# EasyEDA schematic 02 - EasyEDA.json
TITLE: ESPWater; REV: 1.0; Date: 2022-09-15; Sheet: 1/1; Drawn By: ShonP40; Company: https://shon.codes
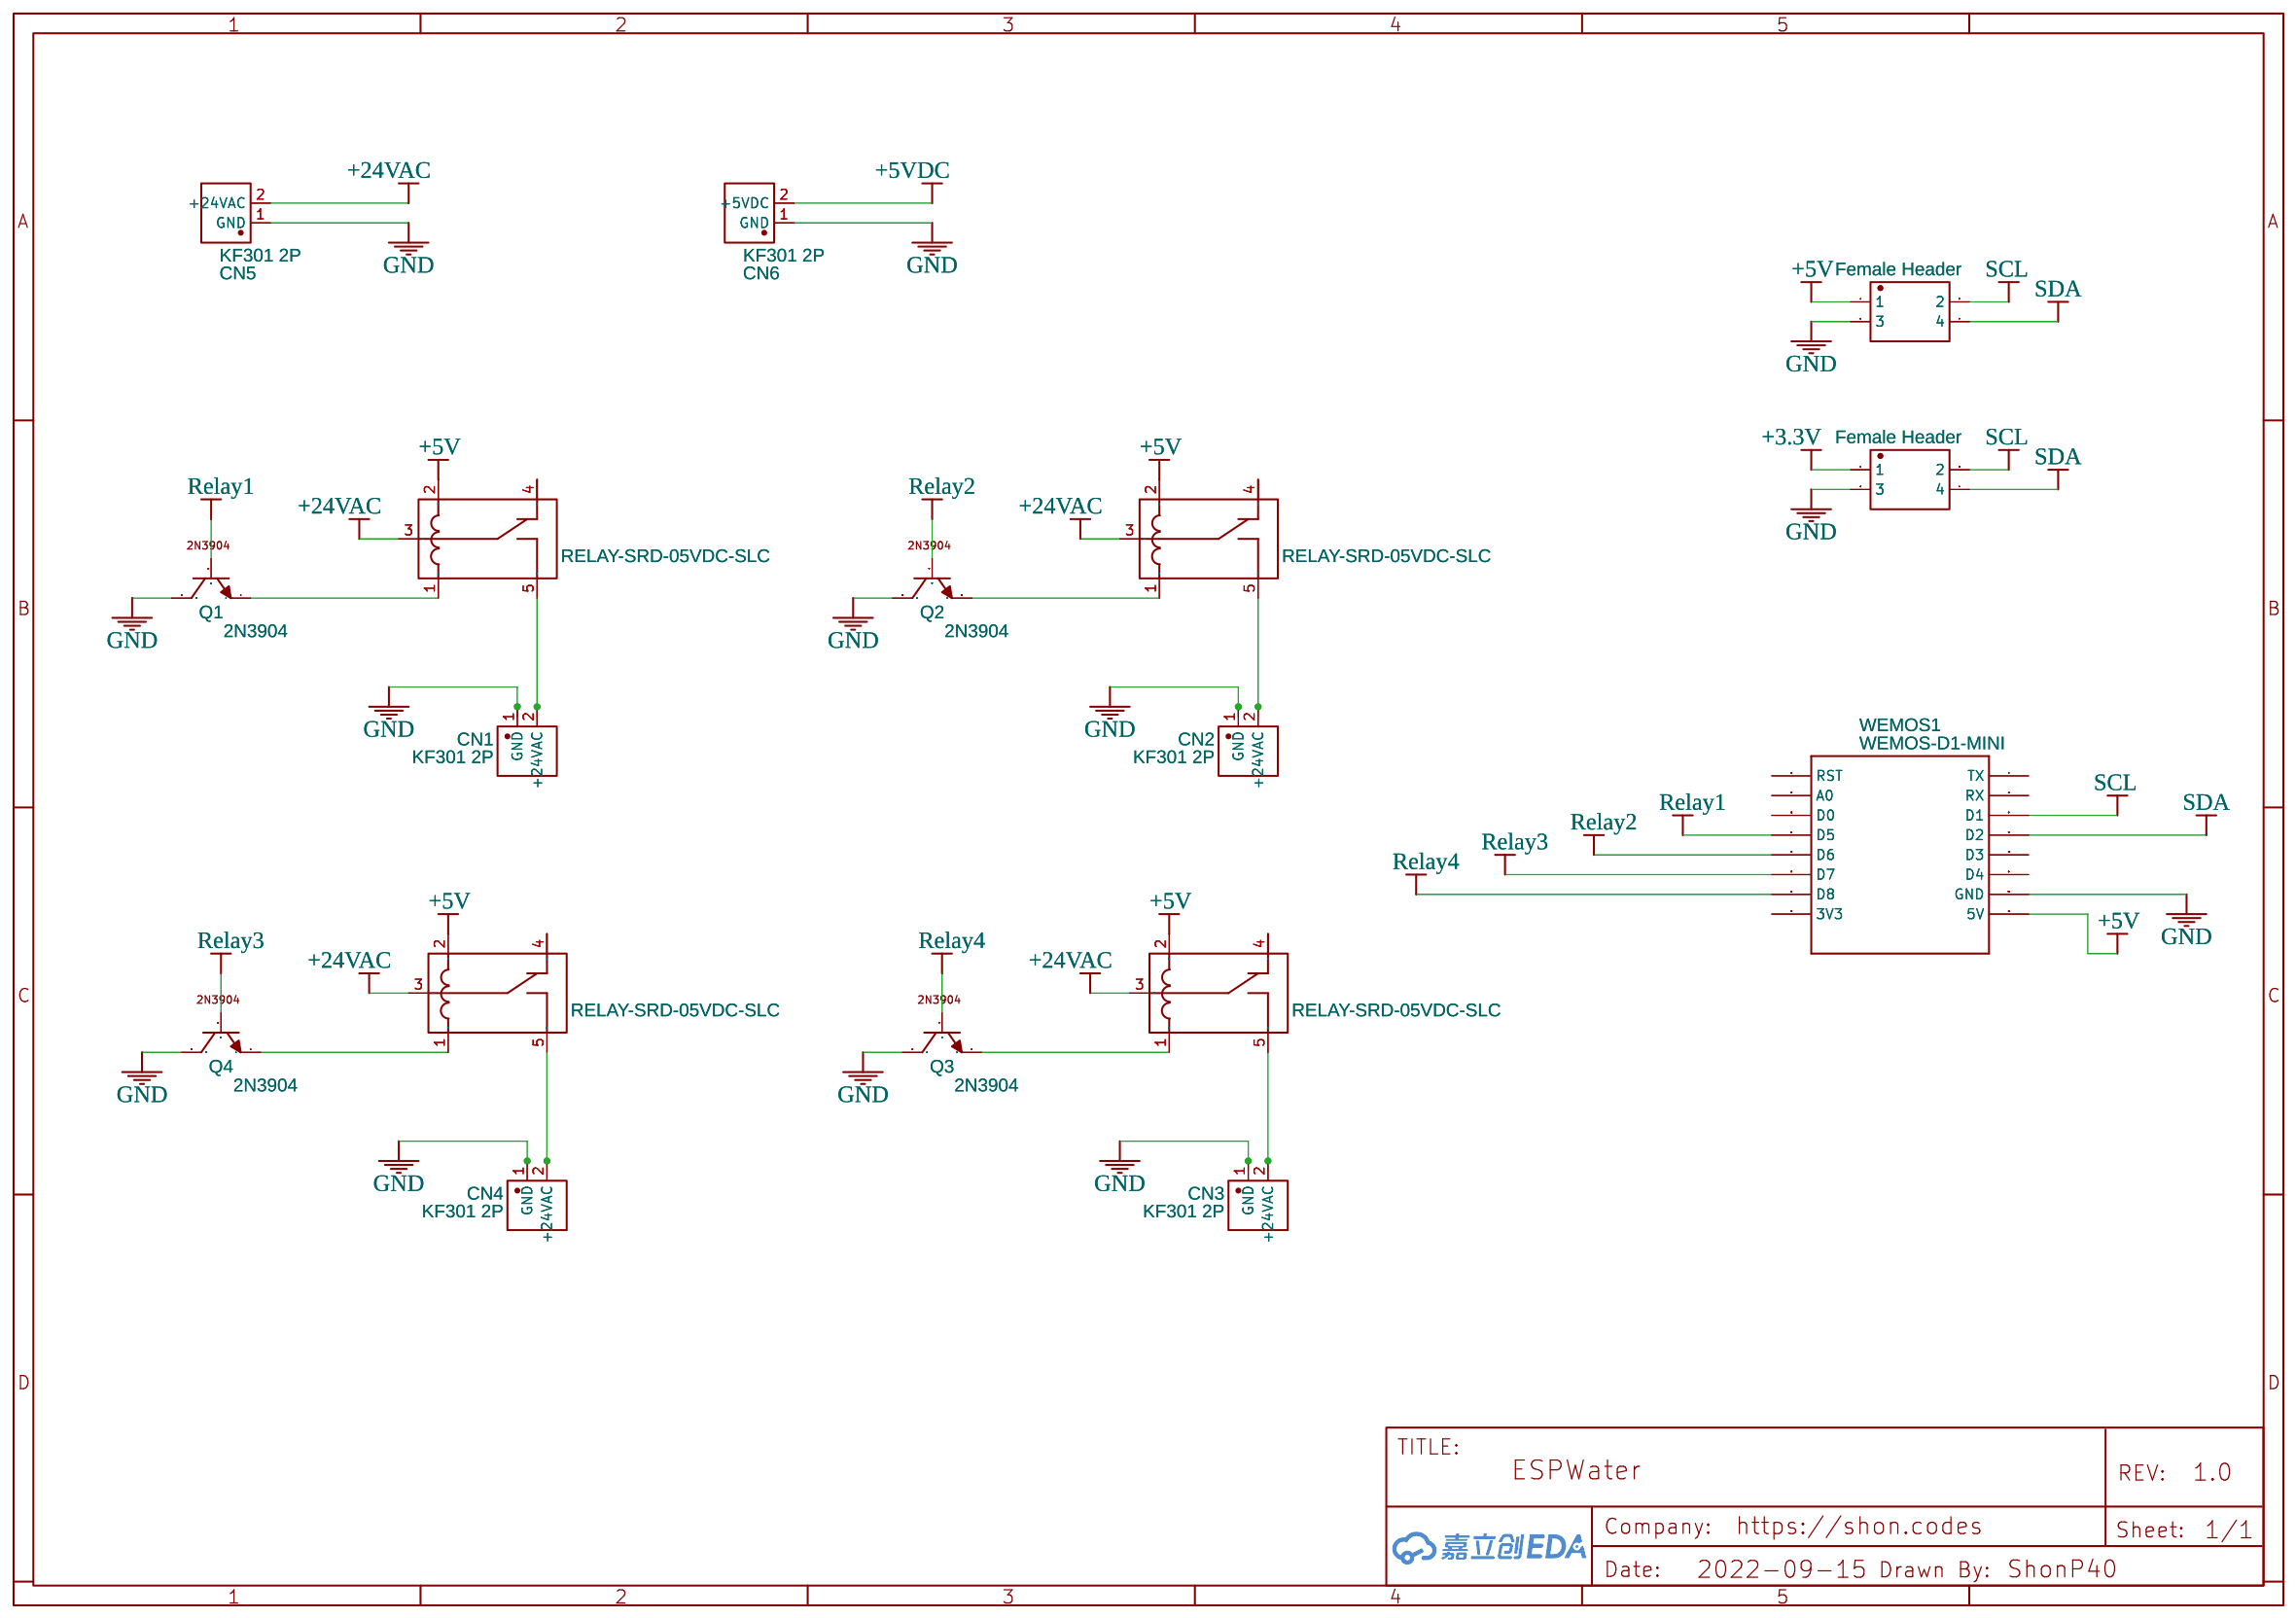
[diagram p0: schematic sheet]

## Parts
1  RELAY-SRD-05VDC-SLC  [RELAY-SRD-05VDC-SL-C]
2  RELAY-SRD-05VDC-SLC  [RELAY-SRD-05VDC-SL-C]
3  RELAY-SRD-05VDC-SLC  [RELAY-SRD-05VDC-SL-C]
4  RELAY-SRD-05VDC-SLC  [RELAY-SRD-05VDC-SL-C]
CN1  KF301 2P  [KF301 2P]
CN2  KF301 2P  [KF301 2P]
CN3  KF301 2P  [KF301 2P]
CN4  KF301 2P  [KF301 2P]
CN5  KF301 2P  [KF301 2P]
CN6  KF301 2P  [KF301 2P]
H1  Female Header  [HDR-TH_4P-P2.54-V-F-R2-C2-S2.54]
H2  Female Header  [HDR-TH_4P-P2.54-V-F-R2-C2-S2.54]
Q1  2N3904  [2N3904]
Q2  2N3904  [2N3904]
Q3  2N3904  [2N3904]
Q4  2N3904  [2N3904]
WEMOS1  WEMOS-D1-MINI  [WEMOS-D1-MINI]

## Library data of the parts
1-4 = RELAY-SRD-05VDC-SLC: Supplier: TME; Contributor: CTAHOK159
CN1-CN6 = KF301 2P: Supplier: LCSC; Supplier Part: C387830; Manufacturer: JILN; Manufacturer Part: JL2EDGRC-50803G01; Contributor: LCSC
H1 H2 = Header-Female-2.54_2x2: Supplier: LCSC; Manufacturer: CONNFLY; Manufacturer Part: DS1023-2*2SF11; Contributor: LCSC; Supplier Part: C92273; JLCPCB Part Class: Extended Part
Q1-Q4 = 2N3904: Supplier: RICCADONNA LUCIANO; Manufacturer: Officine PADANE; JLCPCB Part Class: Extended Part; Contributor: paolonogara1972
WEMOS1 = WEMOS-D1-MINI: WeMos.cc

## Nets
+3.3V: H2.1
+5V: 1.2 2.2 3.2 4.2 H1.1 WEMOS1.5V
+5VDC: CN6.2(+5VDC)
+24VAC: 1.3 2.3 3.3 4.3 CN5.2(+24VAC)
GND: CN1.1(GND) CN2.1(GND) CN3.1(GND) CN4.1(GND) CN5.1(GND) CN6.1(GND) H1.3 H2.3 Q1.3(C) Q2.3(C) Q3.3(C) Q4.3(C) WEMOS1.GND
Relay1: Q1.2(B) WEMOS1.D5
Relay2: Q2.2(B) WEMOS1.D6
Relay3: Q4.2(B) WEMOS1.D7
Relay4: Q3.2(B) WEMOS1.D8
SCL: H1.2 H2.2 WEMOS1.D1
SDA: H1.4 H2.4 WEMOS1.D2
Net-(1-1): 1.1 Q1.1(E)
Net-(1-5): 1.5 CN1.2(+24VAC)
Net-(2-1): 2.1 Q2.1(E)
Net-(2-5): 2.5 CN2.2(+24VAC)
Net-(3-1): 3.1 Q3.1(E)
Net-(3-5): 3.5 CN3.2(+24VAC)
Net-(4-1): 4.1 Q4.1(E)
Net-(4-5): 4.5 CN4.2(+24VAC)

Not connected (* = marked no-connect by the designer): 1 4; 2 4; 3 4; 4 4; WEMOS1 3V3 A0 D0 D3 D4 RST RX TX
